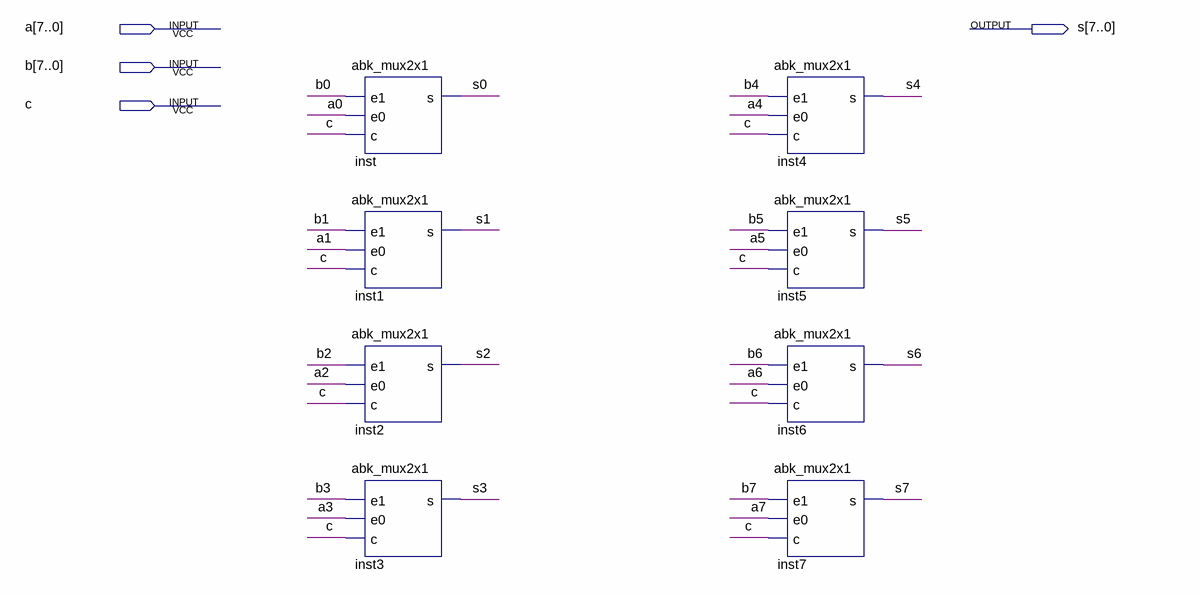
[diagram p0: schematic sheet]
// Quartus schematic abk_mux2x1_8.bdf as structural Verilog: 8 symbols, 4 pins
module abk_mux2x1_8 (
  input  [7:0] a,
  input  [7:0] b,
  input  c,
  output [7:0] s
);

  abk_mux2x1 inst (.e1(b[0]), .e0(a[0]), .c(c), .s(s[0]));
  abk_mux2x1 inst1 (.e1(b[1]), .e0(a[1]), .c(c), .s(s[1]));
  abk_mux2x1 inst2 (.e1(b[2]), .e0(a[2]), .c(c), .s(s[2]));
  abk_mux2x1 inst3 (.e1(b[3]), .e0(a[3]), .c(c), .s(s[3]));
  abk_mux2x1 inst4 (.e1(b[4]), .e0(a[4]), .c(c), .s(s[4]));
  abk_mux2x1 inst5 (.e1(b[5]), .e0(a[5]), .c(c), .s(s[5]));
  abk_mux2x1 inst6 (.e1(b[6]), .e0(a[6]), .c(c), .s(s[6]));
  abk_mux2x1 inst7 (.e1(b[7]), .e0(a[7]), .c(c), .s(s[7]));
endmodule
